# EAGLE design gate delay v2 ctrl (EAGLE 7.7.0)
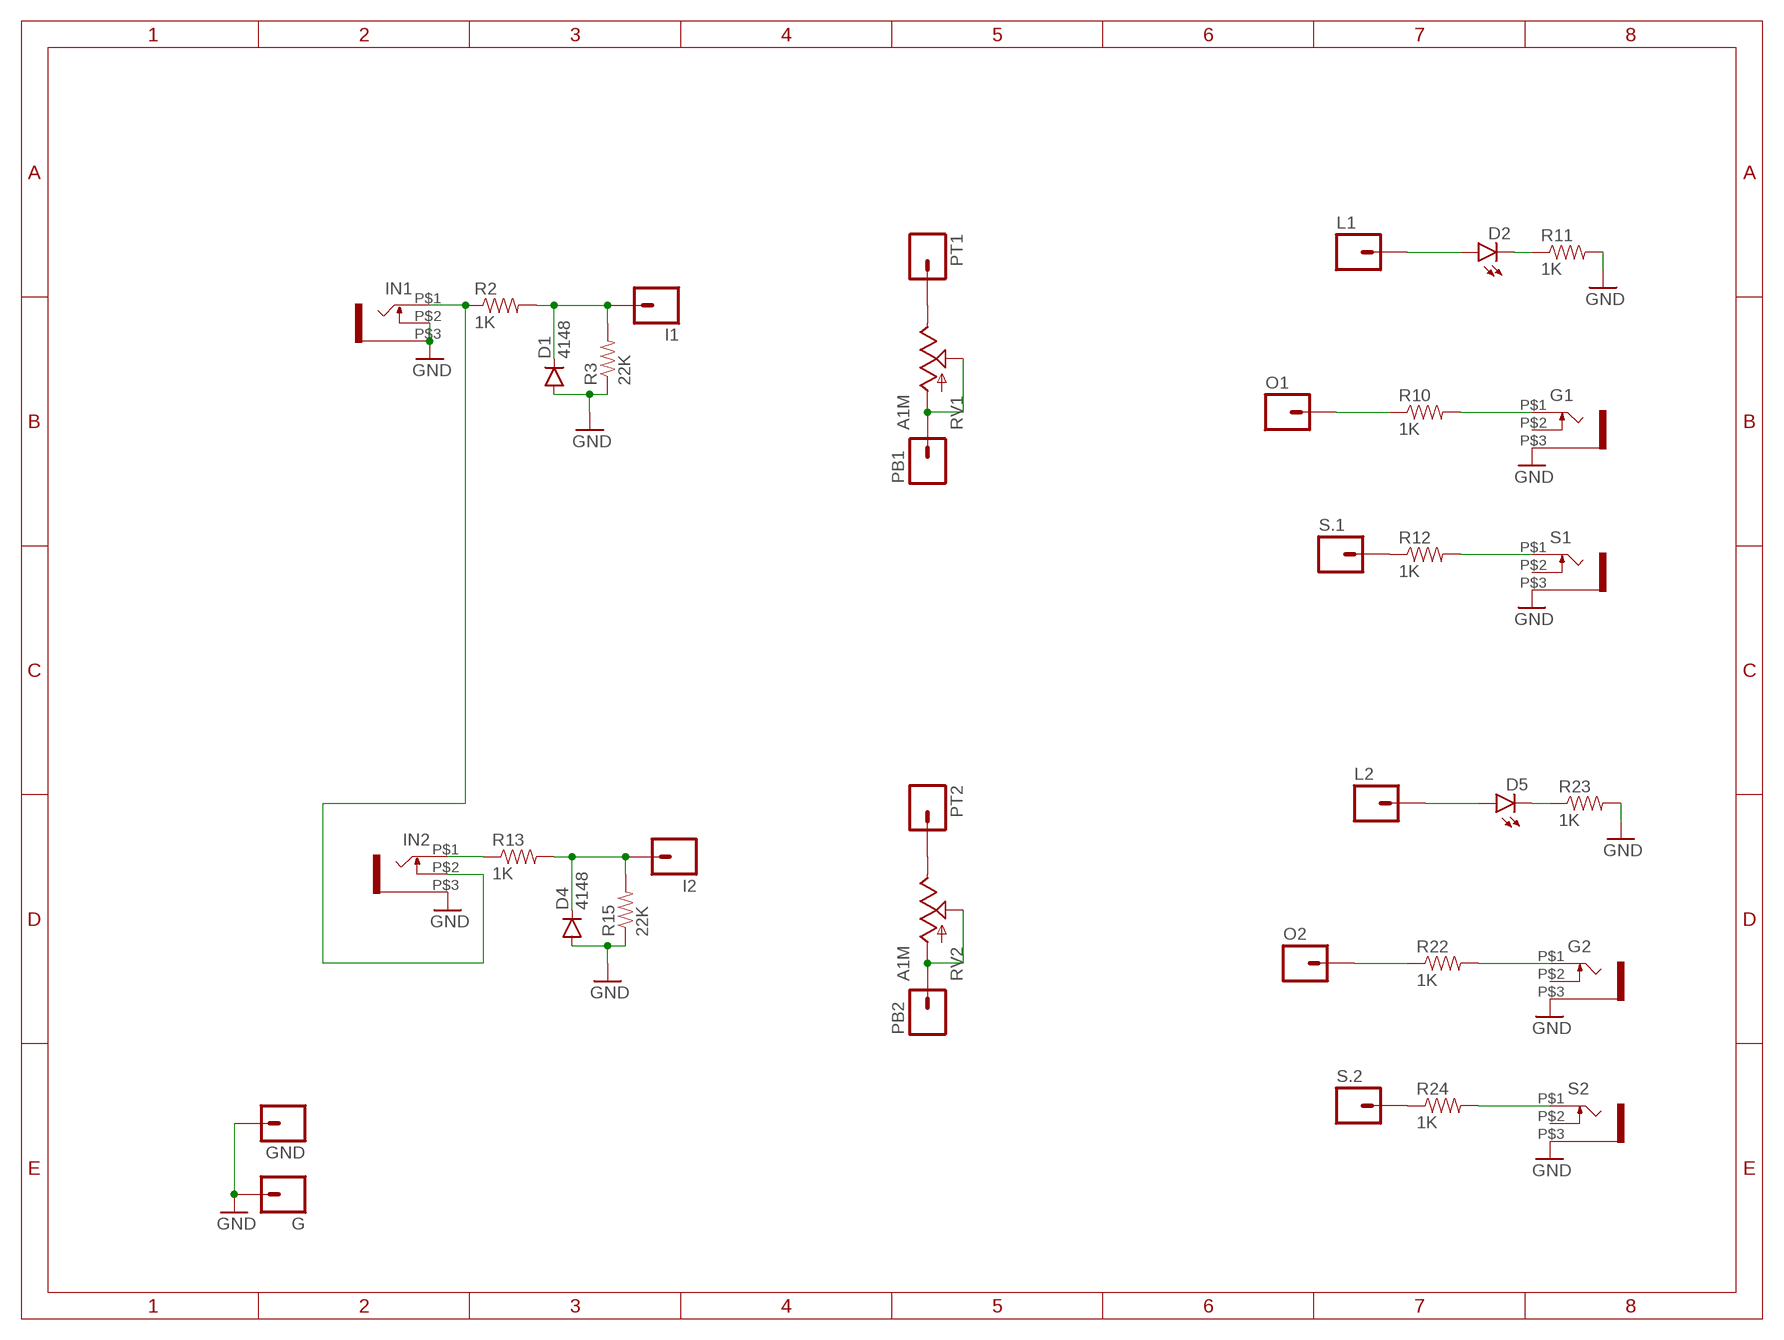
[diagram p0: schematic, sheet 1]

## Parts
D1  4148  DIODESOD123  [SOD-123]
D2  LED3MM  [LED3MM]
D4  4148  DIODESOD123  [SOD-123]
D5  LED3MM  [LED3MM]
G  M01PTH  [1X01]
G1  WQP-PJ301M-12_JACK  [WQP-PJ301M-12_JACK]
G2  WQP-PJ301M-12_JACK  [WQP-PJ301M-12_JACK]
GND  M01PTH  [1X01]
I1  M01PTH  [1X01]
I2  M01PTH  [1X01]
IN1  WQP-PJ301M-12_JACK  [WQP-PJ301M-12_JACK]
IN2  WQP-PJ301M-12_JACK  [WQP-PJ301M-12_JACK]
L1  M01PTH  [1X01]
L2  M01PTH  [1X01]
O1  M01PTH  [1X01]
O2  M01PTH  [1X01]
PB1  M01PTH  [1X01]
PB2  M01PTH  [1X01]
PT1  M01PTH  [1X01]
PT2  M01PTH  [1X01]
R2  1K  RESISTOR0805-RES  [0805@1]
R3  22K  RESISTOR0805-RES  [0805@1]
R10  1K  RESISTOR0805-RES  [0805@1]
R11  1K  RESISTOR0805-RES  [0805@1]
R12  1K  RESISTOR0805-RES  [0805@1]
R13  1K  RESISTOR0805-RES  [0805@1]
R15  22K  RESISTOR0805-RES  [0805@1]
R22  1K  RESISTOR0805-RES  [0805@1]
R23  1K  RESISTOR0805-RES  [0805@1]
R24  1K  RESISTOR0805-RES  [0805@1]
RV1  A1M  POT  [ALPS_POT]
RV2  A1M  POT  [ALPS_POT]
S1  WQP-PJ301M-12_JACK  [WQP-PJ301M-12_JACK]
S2  WQP-PJ301M-12_JACK  [WQP-PJ301M-12_JACK]
S.1  M01PTH  [1X01]
S.2  M01PTH  [1X01]

## Nets
GND: D1.A D4.A G1.P$3 G2.P$3 G.1 GND.1 IN1.P$2 IN1.P$3 IN2.P$3 R3.1 R11.2 R15.1 R23.2 S1.P$3 S2.P$3
N$1: IN1.P$1 IN2.P$2 R2.1
N$2: D1.C I1.1 R2.2 R3.2
N$3: R12.1 S.1.1
N$4: R24.1 S.2.1
N$5: IN2.P$1 R13.1
N$6: PT1.1 RV1.P$1(E)
N$7: PB1.1 RV1.P$2(S) RV1.P$3(A)
N$8: O1.1 R10.1
N$9: PT2.1 RV2.P$1(E)
N$10: PB2.1 RV2.P$2(S) RV2.P$3(A)
N$12: D2.A L1.1
N$13: D2.K(C) R11.1
N$14: G1.P$1 R10.2
N$16: R12.2 S1.P$1
N$17: D4.C I2.1 R13.2 R15.2
N$23: O2.1 R22.1
N$26: D5.A L2.1
N$27: D5.K(C) R23.1
N$28: G2.P$1 R22.2
N$30: R24.2 S2.P$1
Unconnected: G1.P$2 G2.P$2 S1.P$2 S2.P$2

## Library data of the parts
D1 D4 = SparkFun-DiscreteSemi:DIODE: Diode These are standard reverse protection diodes and small signal diodes. SMA package can handle up to about 1A. SOD-323 can handle about 200mA. What the SOD-323 package when ordering, there are some mfgs out there that are 5-pin packages.
D2 D5 = SparkFun-LED:LED: LEDs Standard schematic elements and footprints for 5mm, 3mm, 1206, and 0603 sized LEDs. 5mm - Spark Fun Electronics SKU : COM-00529 (and others)
G GND I1 I2 L1 L2 O1 O2 PB1 PB2 PT1 PT2 S.1 S.2 = SparkFun-Connectors:M01: Header 1 Standard 1-pin 0.1" header. Use with straight break away headers (SKU : PRT-00116), right angle break away headers (PRT-00553), swiss pins (PRT-00743), machine pins (PRT-00117), and female headers (PRT-00115).
G1 G2 IN1 IN2 S1 S2 = thonkiconn:WQP-PJ301M-12_JACK
R2 R3 R10-R13 R15 R22-R24 = SparkFun-Passives:RESISTOR: Resistor Basic schematic elements and footprints for 0603, 1206, and PTH resistors.
RV1 RV2 = SparkFun-Electromechanical:POT; PROD_ID: RES-09177

## Board
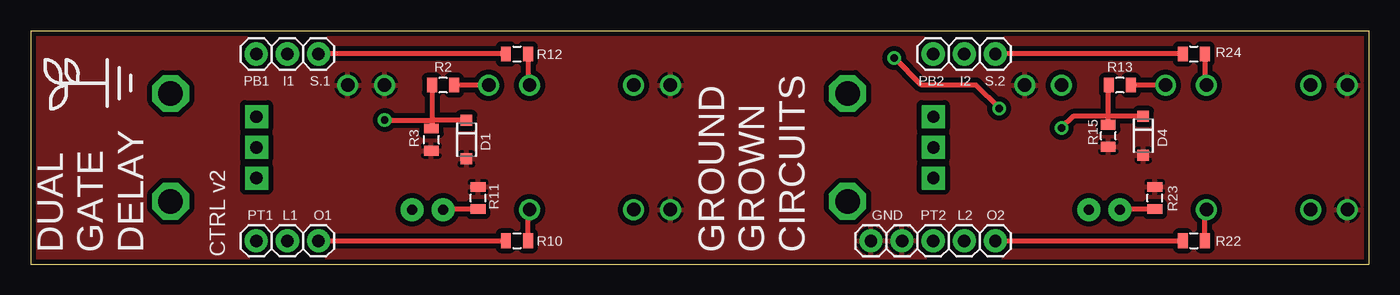
[diagram p1: board, top side]
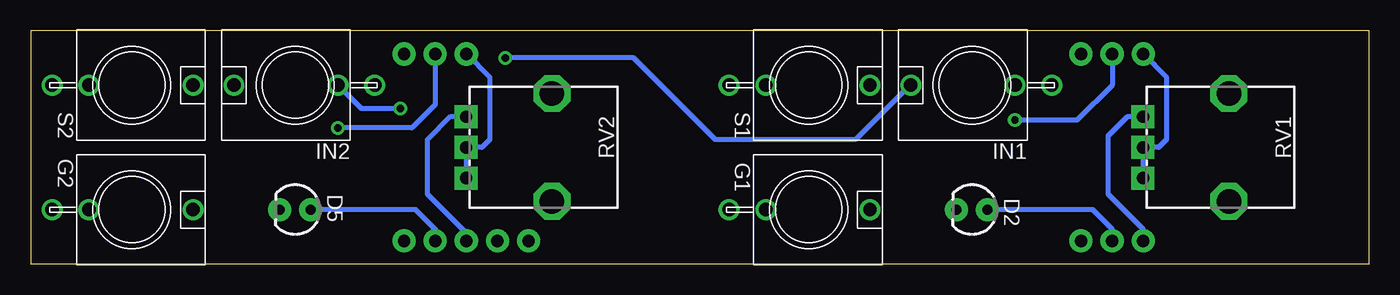
[diagram p2: board, bottom side, seen from below]

Size 109.22 x 19.05 mm. Coordinates in mm from the lower left corner, seen from the top.
Outline: 0,0 109.22,0 109.22,19.05 0,19.05 0,0
Copper layers (1*16): Top 0.035mm / dielectric 1.5mm / Bottom 0.035mm
Design rules "SparkFun": minimum track width 8mil, minimum drill 20mil, track to track 8mil, track to pad 8mil, pad to pad 8mil, via to via 8mil, smd to smd 8mil, copper to edge 8mil, drill to drill 8mil, minimum pad ring 12mil, minimum via ring 10mil, stop-mask expansion 4mil, vias tented up to drill 20mil, thermal gap 10mil

### Footprints (pad centres in the part's own frame; a part is rotated, then mirrored left to right if it is on the bottom)
SOD-123 = smd 0.9 x 0.95: A 1.575,0; C -1.575,0
LED3MM = drill 0.813 pad 1.88: A -1.27,0; K 1.27,0
1X01 = drill 1.016 pad 1.88: 1 0,0
WQP-PJ301M-12_JACK = drill 1.1: P$1 0,5; P$2 0,-3.5; P$3 0,-6.5
0805@1 = smd 0.8 x 1.2: 1 -0.9,0; 2 0.9,0
ALPS_POT = drill 1 pad 1.88 square: P$1 7,-2.5; P$2 7,0; P$3 7,2.5 | drill 2 octagon: P$4 0,-4.4; P$5 0,4.4

### Placement (x,y rotation side)
D1  35.56,10.16 270 top
D2  32.38,4.45 180 bottom
D4  90.81,10.48 270 top
D5  87.63,4.45 180 bottom
G  71.12,1.91 0 top
G1  45.72,4.45 270 bottom
G2  100.97,4.45 270 bottom
GND  68.58,1.91 0 top
I1  20.95,17.14 0 top
I2  76.2,17.14 0 top
IN1  32.38,14.61 90 bottom
IN2  87.63,14.61 90 bottom
L1  20.95,1.91 0 top
L2  76.2,1.91 0 top
O1  23.5,1.91 0 top
O2  78.74,1.91 0 top
PB1  18.41,17.14 0 top
PB2  73.66,17.14 0 top
PT1  18.41,1.91 0 top
PT2  73.66,1.91 0 top
R2  33.66,14.61 180 top
R3  32.7,10.16 90 top
R10  39.69,1.91 0 top
R11  36.51,5.4 90 top
R12  39.69,17.14 0 top
R13  88.9,14.61 180 top
R15  87.95,10.48 90 top
R22  94.93,1.91 0 top
R23  91.76,5.4 90 top
R24  94.93,17.14 0 top
RV1  11.43,9.53 180 bottom
RV2  66.67,9.53 180 bottom
S1  45.72,14.61 270 bottom
S2  100.97,14.61 270 bottom
S.1  23.5,17.14 0 top
S.2  78.74,17.14 0 top
U$2  [LOGO_SMALL]  6.19,14.76 90 top

### Tracks (layer width: path | path; a pad name or v marks a point on that pad's centre or on a via)
GND
  pour Top (isolate 0.406): 0,0 0,19.05 109.22,19.05 109.22,0
N$1  (via drill 0.6)
  Top 0.406: IN1.P$1 R2.1 | v79.06,12.7 77.15,14.61 72.71,14.61 v70.48,16.83
  Bottom 0.406: IN1.P$1 37.47,14.61 41.91,10.16 53.34,10.16 60.01,16.83 v70.48,16.83 | IN2.P$2 84.13,14.6 82.23,12.7 v79.06,12.7
N$2  (via drill 0.6)
  Top 0.406: R2.2 32.76,11.75 | 32.76,11.75 32.76,11.11 R3.2 | D1.C 32.77,11.73 32.76,11.75 | v28.89,11.75 32.76,11.75
  Bottom 0.406: I1.1 20.95,14.61 23.81,11.75 v28.89,11.75
N$3
  Top 0.406: R12.1 S.1.1
N$4
  Top 0.406: R24.1 S.2.1
N$5
  Top 0.406: IN2.P$1 R13.1
N$6
  Bottom 0.406: PT1.1 18.41,2.86 21.27,5.71 21.27,10.48 19.68,12.06 18.47,12.06 RV1.P$1
N$7
  Bottom 0.406: RV1.P$3 RV1.P$2 17.14,9.53 16.51,10.16 16.51,15.24 PB1.1
N$8
  Top 0.406: O1.1 R10.1
N$9
  Bottom 0.406: PT2.1 73.66,2.54 76.83,5.71 76.83,10.16 74.93,12.06 73.72,12.06 RV2.P$1
N$10
  Bottom 0.406: PB2.1 71.75,15.24 71.75,10.16 72.39,9.53 RV2.P$2 RV2.P$3
N$12
  Bottom 0.406: L1.1 20.95,2.86 22.54,4.45 D2.A
N$13
  Top 0.406: R11.1 33.71,4.5 D2.K
N$14
  Top 0.406: R10.2 40.59,4.31 G1.P$1
N$16
  Top 0.406: R12.2 40.59,14.74 S1.P$1
N$17  (via drill 0.6)
  Top 0.406: R15.2 87.95,12.06 | 87.95,12.06 87.95,14.55 R13.2 | D4.C 87.96,12.05 87.95,12.06 | 87.95,12.06 85.09,12.06 v84.14,11.11
  Bottom 0.406: I2.1 76.2,13.02 78.11,11.11 v84.14,11.11
N$23
  Top 0.406: O2.1 R22.1
N$26
  Bottom 0.406: L2.1 76.2,2.86 77.79,4.45 D5.A
N$27
  Top 0.406: R23.1 88.95,4.5 D5.K
N$28
  Top 0.406: R22.2 95.83,4.31 G2.P$1
N$30
  Top 0.406: R24.2 95.83,14.74 S2.P$1

### Text on the board
tPlace: DUAL / GATE / DELAY | CTRL v2 | GROUND / GROWN / CIRCUITS